# EAGLE design acrylic-sign schematic (EAGLE 9.4.2)
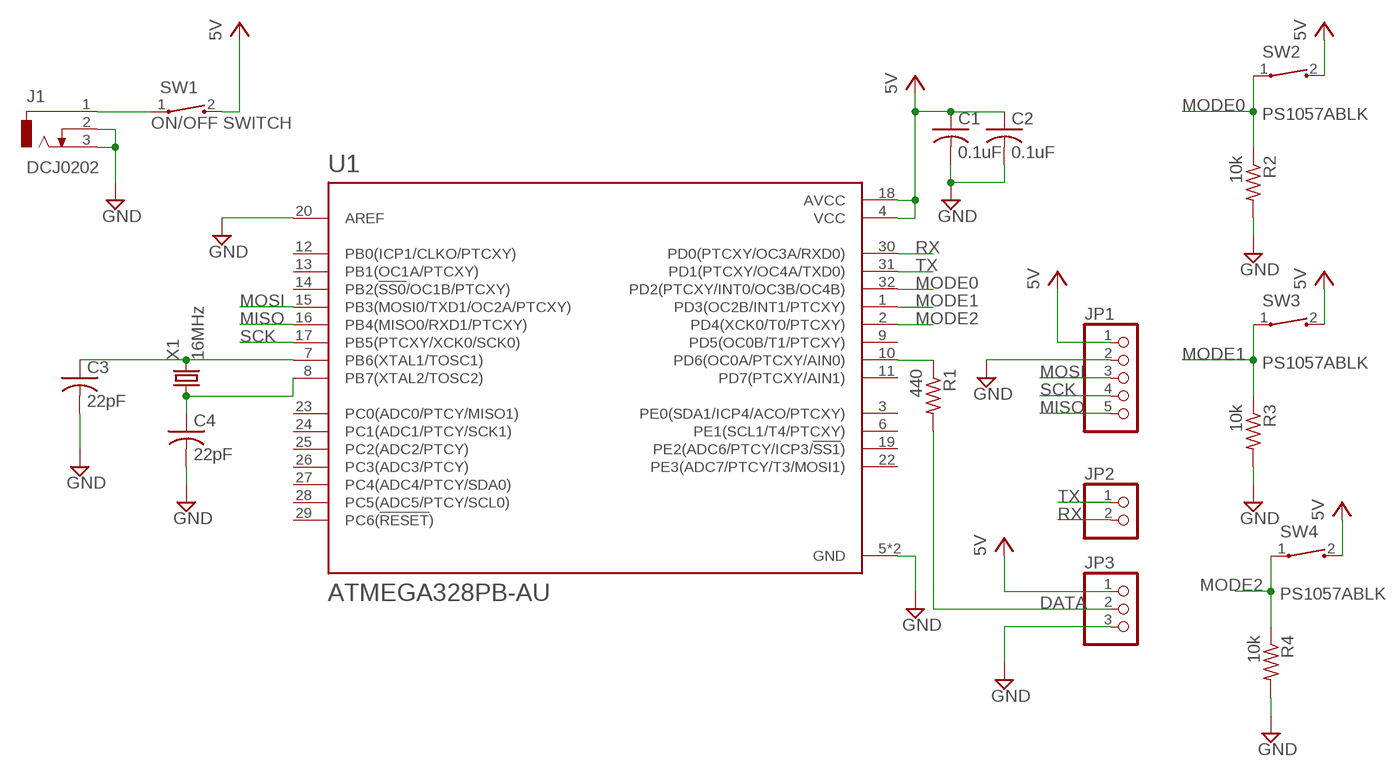
[diagram p0: schematic, sheet 1]

## Parts
C1  0.1uF  C-USC0603  [C0603]
C2  0.1uF  C-USC0603  [C0603]
C3  22pF  C-USC0603  [C0603]
C4  22pF  C-USC0603  [C0603]
J1  DCJ0202  [DCJ0202]
JP1  PINHD-1X5  [1X05]
JP2  PINHD-1X2  [1X02]
JP3  PINHD-1X3  [1X03]
R1  440  R-US_R0603  [R0603]
R2  10k  R-US_R0603  [R0603]
R3  10k  R-US_R0603  [R0603]
R4  10k  R-US_R0603  [R0603]
SW1  AMAZON_SWITCH  [1X2-3.5MM]
SW2  PS1057ABLK  [1X2-3.5MM]
SW3  PS1057ABLK  [1X2-3.5MM]
SW4  PS1057ABLK  [1X2-3.5MM]
U1  ATMEGA328PB-AU  [QFP80P900X900X120-32N]
X1  16MHz  NX5032GA-16MHZ-STD-CSK-4  [2-SMD-5X3]

## Nets
DATA: JP3.2 R1.2
GND: C1.2 C2.2 C3.2 C4.2 J1.2 J1.3 JP1.2 JP3.3 R2.2 R3.2 R4.2 U1.5(GND) U1.20(AREF) U1.21(GND)
MISO: JP1.5 U1.16(PB4(MISO0/RXD1/PTCXY))
MODE0: R2.1 SW2.1 U1.32(PD2(PTCXY/INT0/OC3B/OC4B))
MODE1: R3.1 SW3.1 U1.1(PD3(OC2B/INT1/PTCXY))
MODE2: R4.1 SW4.1 U1.2(PD4(XCK0/T0/PTCXY))
MOSI: JP1.3 U1.15(PB3(MOSI0/TXD1/OC2A/PTCXY))
N$1: J1.1 SW1.1
N$2: C3.1 U1.7(PB6(XTAL1/TOSC1)) X1.2
N$3: C4.1 U1.8(PB7(XTAL2/TOSC2)) X1.1
N$4: R1.1 U1.10(PD6(OC0A/PTCXY/AIN0))
RX: JP2.2 U1.30(PD0(PTCXY/OC3A/RXD0))
SCK: JP1.4 U1.17(PB5(PTCXY/XCK0/SCK0))
TX: JP2.1 U1.31(PD1(PTCXY/OC4A/TXD0))
VCC: C1.1 C2.1 JP1.1 JP3.1 SW1.2 SW2.2 SW3.2 SW4.2 U1.4(VCC) U1.18(AVCC) ; supply symbol labelled 5V
Unconnected: U1.3(PE0(SDA1/ICP4/ACO/PTCXY)) U1.6(PE1(SCL1/T4/PTCXY)) U1.9(PD5(OC0B/T1/PTCXY)) U1.11(PD7(PTCXY/AIN1)) U1.12(PB0(ICP1/CLKO/PTCXY)) U1.13(PB1(OC1A/PTCXY)) U1.14(PB2(!SS0!/OC1B/PTCXY)) U1.19(PE2(ADC6/PTCY/ICP3/!SS1!)) U1.22(PE3(ADC7/PTCY/T3/MOSI1)) U1.23(PC0(ADC0/PTCY/MISO1)) U1.24(PC1(ADC1/PTCY/SCK1)) U1.25(PC2(ADC2/PTCY)) U1.26(PC3(ADC3/PTCY)) U1.27(PC4(ADC4/PTCY/SDA0)) U1.28(PC5(ADC5/PTCY/SCL0)) U1.29(PC6(!RESET!))

## Notes on the sheet
- ON/OFF SWITCH

## Library data of the parts
C1-C4 = adafruit:C-US: CAPACITOR, American symbol
J1 = con-jack:DCJ0202: DC POWER JACK Source: DCJ0202.pdf; OC_FARNELL: unknown; OC_NEWARK: unknown
JP1 = pinhead:PINHD-1X5: PIN HEADER
JP2 = pinhead:PINHD-1X2: PIN HEADER
JP3 = pinhead:PINHD-1X3: PIN HEADER
R1-R4 = adafruit:R-US_: RESISTOR, American symbol
SW1 = acrylic-sign-lib:AMAZON_SWITCH
SW2-SW4 = acrylic-sign-lib:PS1057ABLK
U1 = ATMEGA328PB-AU:ATMEGA328PB-AU: ATmega Series 20 MHz 32 KB Flash 2 KB SRAM 8-Bit Microcontroller - TQFP-32; DESCRIPTION: AVR microcontroller; EEPROM: 1024B; SRAM: 2kB; Flash: 32kB; TQFP32; DIGI-KEY_PART_NUMBER: ATMEGA328PB-AU-ND; DIGI-KEY_PURCHASE_URL: https://www.digikey.com/product-detail/en/microchip-technology/ATMEGA328PB-AU/ATMEGA328PB-AU-ND/5638812?utm_source=snapeda&utm_medium=aggregator&utm_campaign=symbol; MF: Microchip; MP: ATMEGA328PB-AU; PACKAGE: TQFP-32 Microchip
X1 = acrylic-sign-lib:NX5032GA-16MHZ-STD-CSK-4

## Board
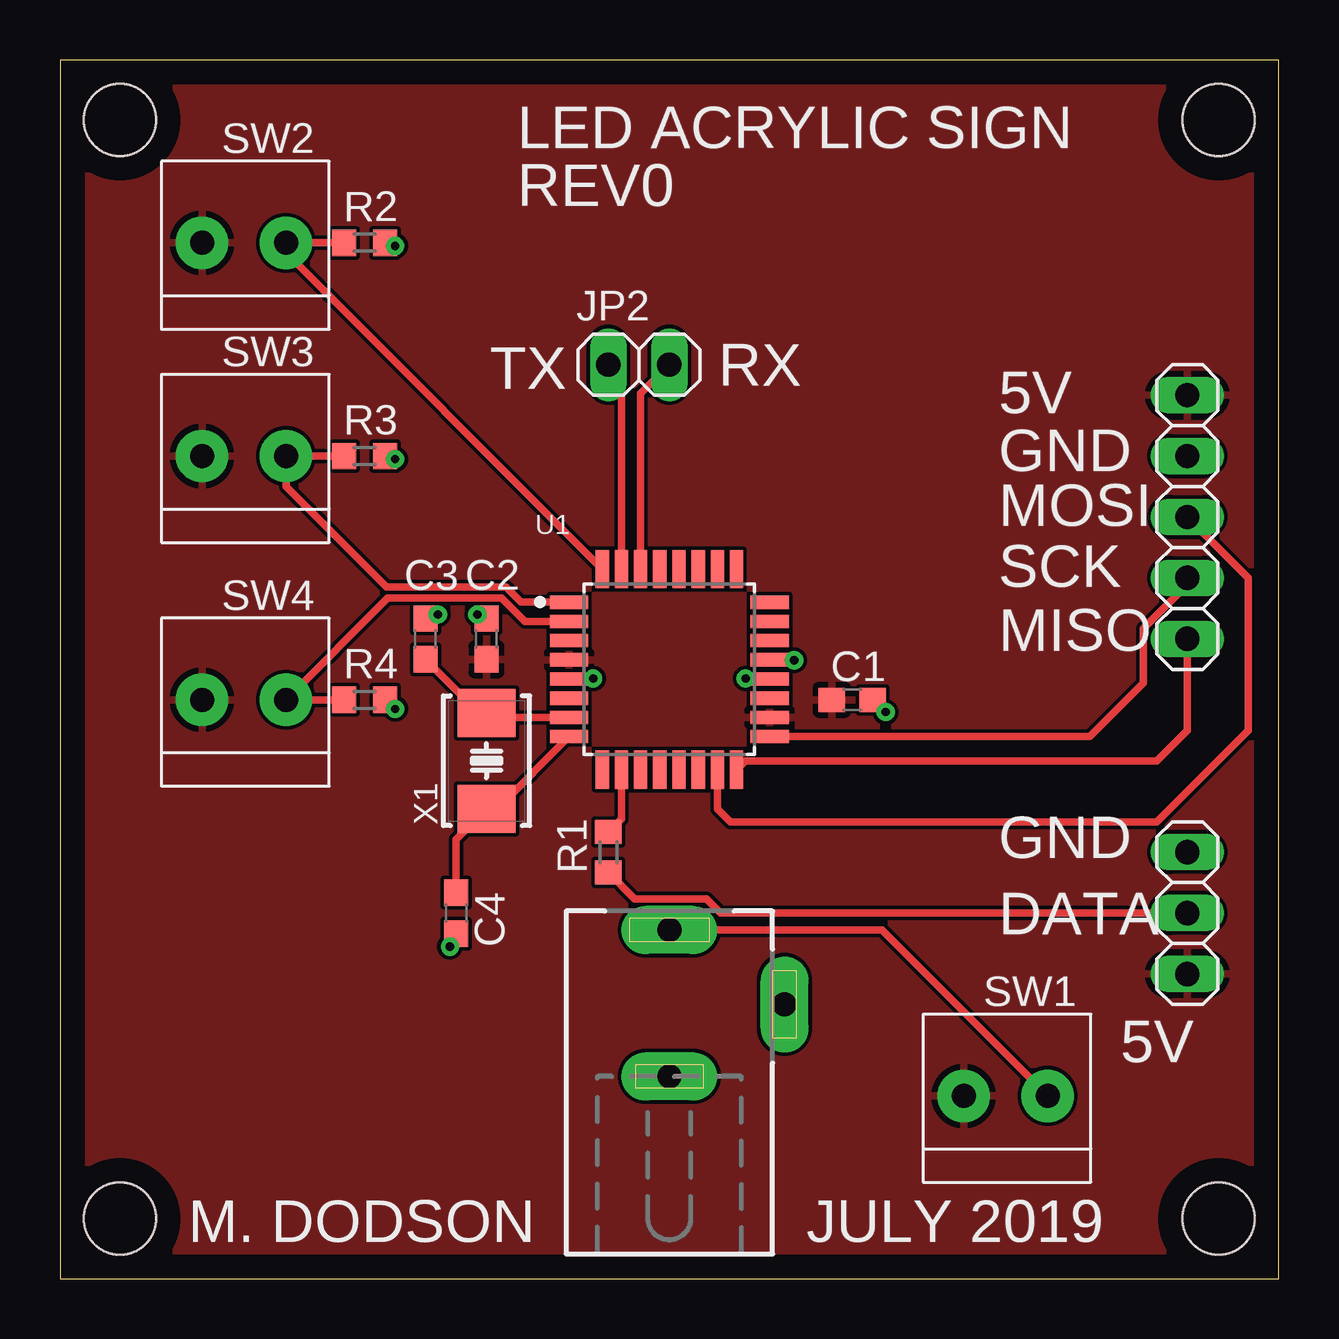
[diagram p1: board, top side]
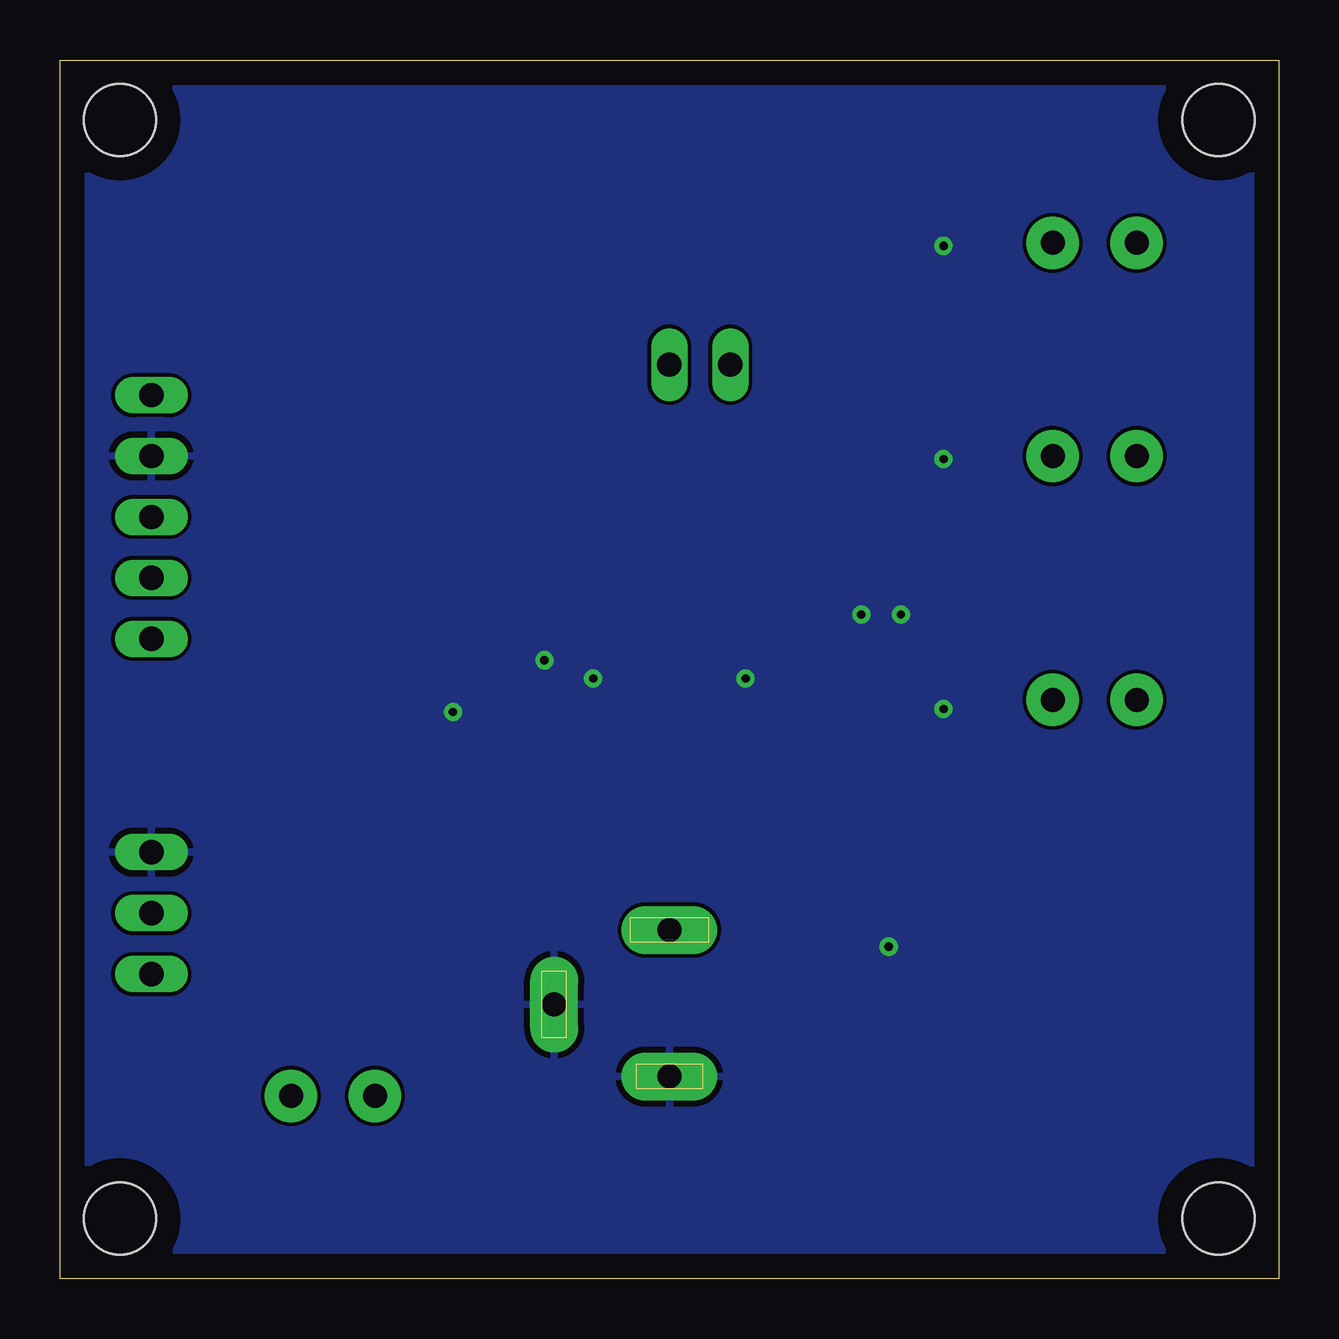
[diagram p2: board, bottom side, seen from below]

Size 50.8 x 50.8 mm. Coordinates in mm from the lower left corner, seen from the top.
Outline: 0,0 50.8,0 50.8,50.8 0,50.8 0,0
Copper layers (1*16): Top 0.035mm / dielectric 1.5mm / Bottom 0.035mm
Design rules "default": minimum track width 6mil, minimum drill 0.35mm, track to track 6mil, track to pad 6mil, pad to pad 6mil, via to via 6mil, smd to smd 6mil, copper to edge 40mil, drill to drill 6mil, minimum pad ring 10mil, minimum via ring 8mil, stop-mask expansion 4mil, vias tented up to drill 0mil, thermal gap 10mil
Holes 3 mm at 2.5,2.5 2.5,48.3 48.3,48.3 48.3,2.5

### Footprints (pad centres in the part's own frame; a part is rotated, then mirrored left to right if it is on the bottom)
C0603 = smd 1.1 x 1: 1 -0.85,0; 2 0.85,0
DCJ0202 = drill 1 pad 2 long: 1 0,3.1; 2 4.8,0; 3 0,-3
1X05 = drill 1.016 long: 1 -5.08,0; 2 -2.54,0; 3 0,0; 4 2.54,0; 5 5.08,0
1X02 = drill 1.016 long: 1 -1.27,0; 2 1.27,0
1X03 = drill 1.016 long: 1 -2.54,0; 2 0,0; 3 2.54,0
R0603 = smd 1 x 1.1: 1 -0.85,0; 2 0.85,0
1X2-3.5MM = drill 1 pad 2.184: 1 1.8,0; 2 -1.7,0
QFP80P900X900X120-32N = smd 1.6 x 0.55: 1 -4.18,2.8; 2 -4.18,2; 3 -4.18,1.2; 4 -4.18,0.4; 5 -4.18,-0.4; 6 -4.18,-1.2; 7 -4.18,-2; 8 -4.18,-2.8; 17 4.18,-2.8; 18 4.18,-2; 19 4.18,-1.2; 20 4.18,-0.4; 21 4.18,0.4; 22 4.18,1.2; 23 4.18,2; 24 4.18,2.8 | smd 0.55 x 1.6: 9 -2.8,-4.18; 10 -2,-4.18; 11 -1.2,-4.18; 12 -0.4,-4.18; 13 0.4,-4.18; 14 1.2,-4.18; 15 2,-4.18; 16 2.8,-4.18; 25 2.8,4.18; 26 2,4.18; 27 1.2,4.18; 28 0.4,4.18; 29 -0.4,4.18; 30 -1.2,4.18; 31 -2,4.18; 32 -2.8,4.18
2-SMD-5X3 = smd 2 x 2.4: 1 -2,0; 2 2,0

### Placement (x,y rotation side)
C1  33.02,24.13 0 top
C2  17.78,26.67 90 top
C3  15.24,26.67 90 top
C4  16.51,15.24 270 top
J1  25.4,11.43 0 top
JP1  46.99,31.75 270 top
JP2  24.13,38.1 0 top
JP3  46.99,15.24 90 top
R1  22.86,17.78 270 top
R2  12.7,43.18 0 top
R3  12.7,34.29 0 top
R4  12.7,24.13 0 top
SW1  39.37,7.62 0 top
SW2  7.62,43.18 0 top
SW3  7.62,34.29 0 top
SW4  7.62,24.13 0 top
U1  25.4,25.4 0 top
X1  17.78,21.59 90 top

### Tracks (layer width: path | path; a pad name or v marks a point on that pad's centre or on a via)
DATA
  Top 0.305: R1.2 23.95,15.84 26.94,15.84 27.54,15.24 JP3.2
GND  (via drill 0.35)
  Top 0.305: C1.2 33.91,24.13 v34.42,23.62 | U1.20 28.59,25 v28.57,25.02 | C2.2 17.57,27.52 v17.4,27.69 | C3.2 15.41,27.69 v15.75,27.69 | R4.2 13.59,24.13 v13.97,23.75 | U1.5 21.24,25.02 v22.23,25.02 | R3.2 13.84,34.29 v13.97,34.16 | R2.2 13.84,43.18 v13.97,43.05 | C4.2 16.51,14.1 v16.26,13.84 | v30.61,25.78 29.6,25.78 U1.21
  pour Bottom: 0,50.8 0,0 50.8,0 50.8,50.8
MISO
  Top 0.305: JP1.5 46.99,22.86 45.72,21.59 28.57,21.59 U1.16
MODE0
  Top 0.305: U1.32 9.42,42.76 SW2.1 R2.1
MODE1
  Top 0.305: U1.1 19.23,28.2 18.6,28.83 13.61,28.83 9.42,33.02 SW3.1 R3.1
MODE2
  Top 0.305: R4.1 SW4.1 13.66,28.38 14.61,28.38 18.41,28.38 19.38,27.4 U1.2
MOSI
  Top 0.305: U1.15 27.4,19.59 27.94,19.05 45.72,19.05 49.53,22.86 49.53,29.21 JP1.3
N$1
  Top 0.305: SW1.1 34.26,14.53 J1.1
N$2
  Top 0.305: U1.7 17.97,23.4 | 17.97,23.4 X1.2 | C3.1 17.66,23.4 17.97,23.4
N$3
  Top 0.305: U1.8 18.21,19.59 X1.1 16.51,18.32 C4.1
N$4
  Top 0.305: U1.10 23.4,19.17 R1.1
RX
  Top 0.305: U1.30 24.2,36.9 JP2.2
SCK
  Top 0.305: U1.17 42.92,22.6 45.16,24.84 45.16,27.11 46.99,28.94 JP1.4
TX
  Top 0.305: U1.31 23.4,37.56 JP2.1
VCC
  pour Top: 0,50.8 50.8,50.8 50.8,0 0,0

### Text on the board
tPlace: LED ACRYLIC SIGN | REV0 | TX | RX | 5V | GND | MOSI | SCK | MISO | GND | DATA | 5V | M. DODSON | JULY 2019